# EAGLE design Particle2NodeMCU (EAGLE 7.3.0)
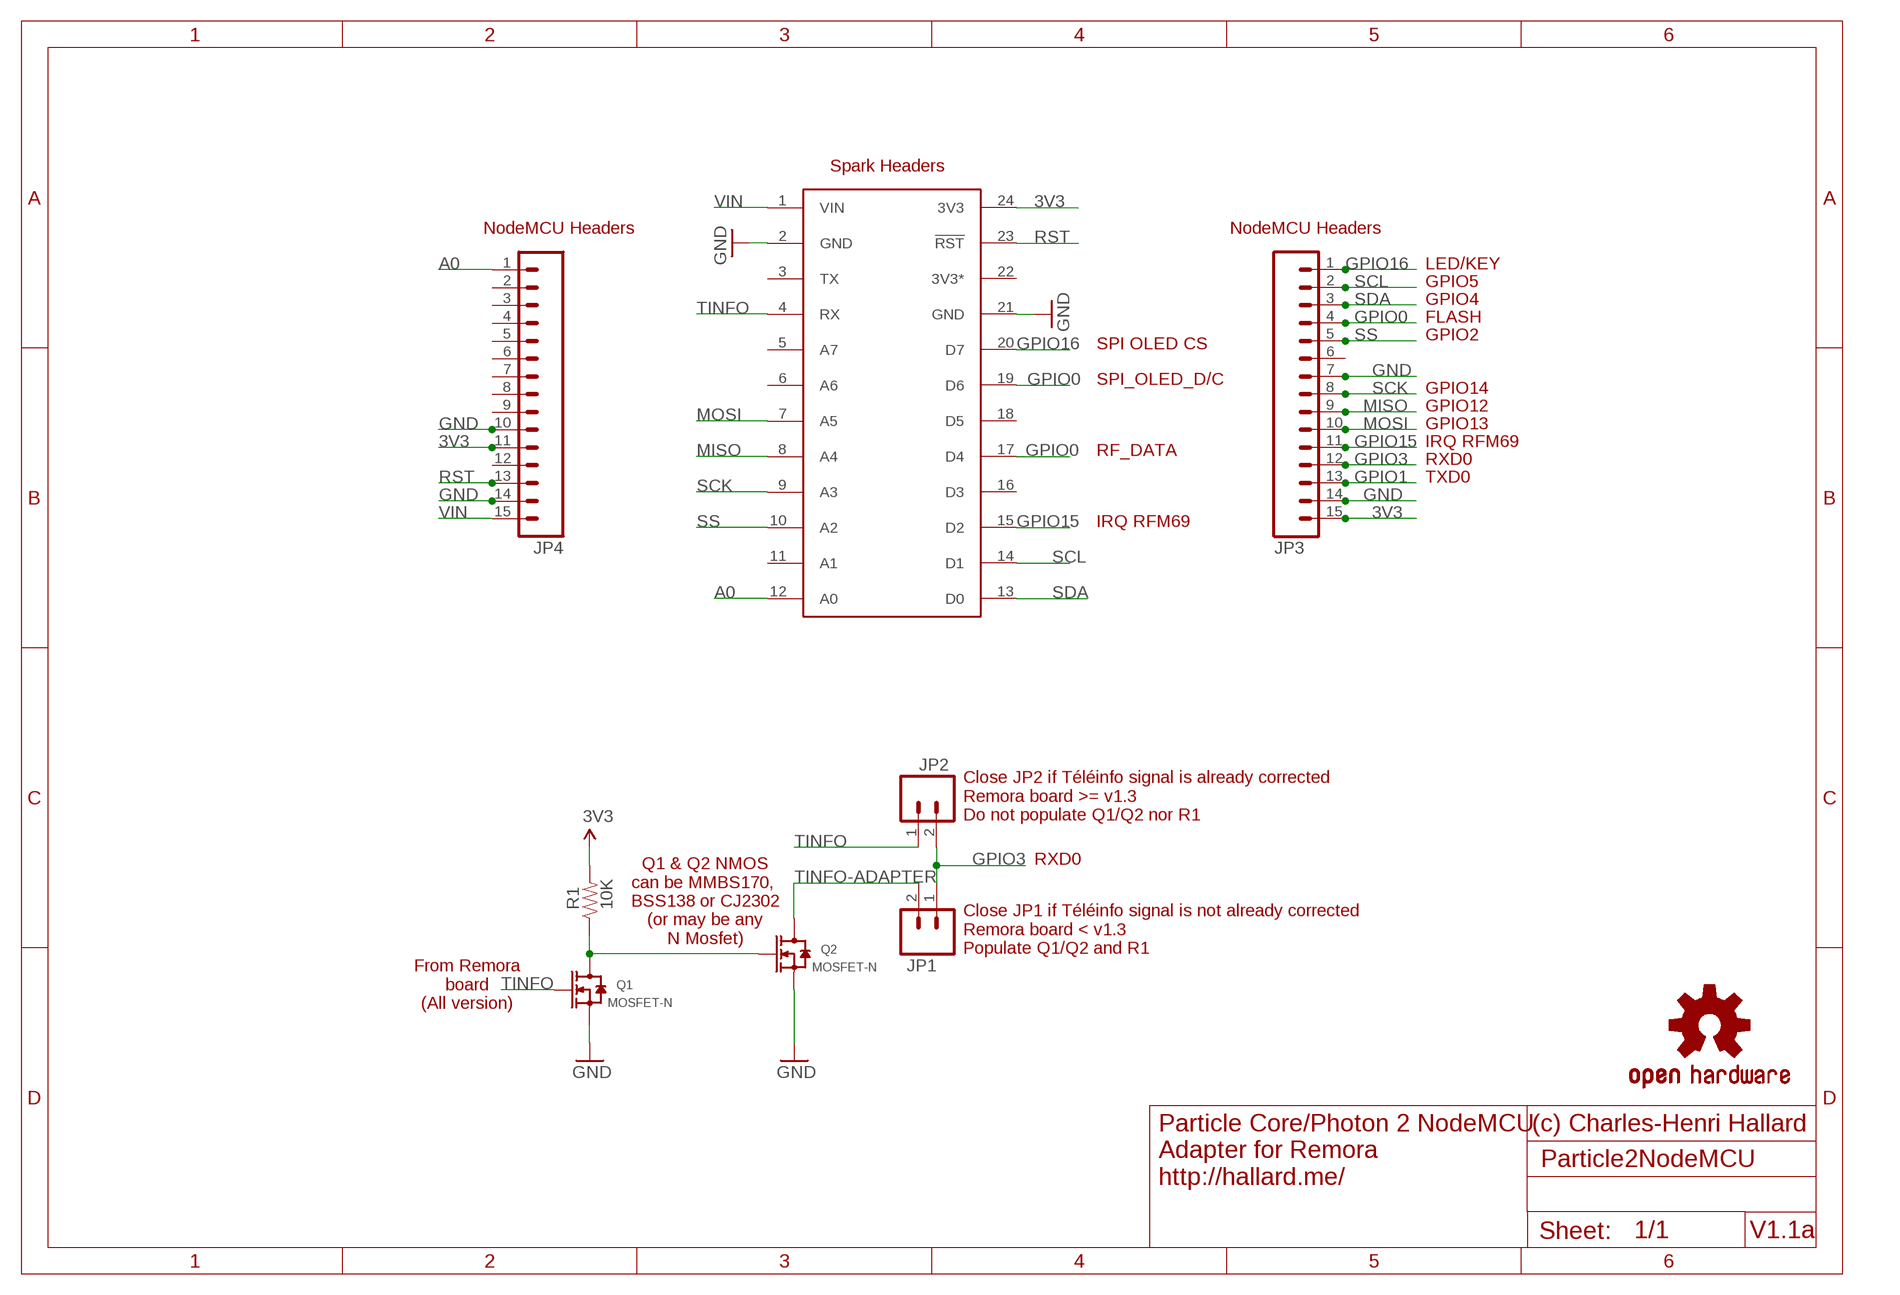
[diagram p0: schematic, sheet 1]

## Parts
JP1  M02LOCK  [1X02_LOCK]
JP2  M02LOCK  [1X02_LOCK]
JP3  M15  [1X15]
JP4  M15  [1X15]
LOGO1  OSHW-LOGOM  [OSHW-LOGO-M]
LOGO2  OSHW-LOGOM  [OSHW-LOGO-M]
Q1  MOSFET-N  MOSFET-N-''  [SOT23]
Q2  MOSFET-N  MOSFET-N-''  [SOT23]
R1  10K  RESISTOR0805-RES  [0805-RES]
U$2  SPARK_CORECORE  [SPARK_CORE]

## Nets
3V3: JP3.15 JP4.11 R1.2 U$2.24(3V3)
A0: JP4.1 U$2.12(A0)
GND: JP3.7 JP3.14 JP4.10 JP4.14 Q1.2(S) Q2.2(S) U$2.2(GND) U$2.21(GND)
GPIO0: JP3.4 U$2.17(D4) U$2.19(D6)
GPIO1: JP3.13
GPIO3: JP1.1 JP2.2 JP3.12
GPIO15: JP3.11 U$2.15(D2)
GPIO16: JP3.1 U$2.20(D7)
MISO: JP3.9 U$2.8(A4)
MOSI: JP3.10 U$2.7(A5)
N$3: Q1.3(D) Q2.1(G) R1.1
RST: JP4.13 U$2.23(!RST)
SCK: JP3.8 U$2.9(A3)
SCL: JP3.2 U$2.14(D1)
SDA: JP3.3 U$2.13(D0)
SS: JP3.5 U$2.10(A2)
TINFO: JP2.1 Q1.1(G) U$2.4(RX)
TINFO-ADAPTER: JP1.2 Q2.3(D)
VIN: JP4.15 U$2.1(VIN)
Unconnected: JP3.6 JP4.2 JP4.3 JP4.4 JP4.5 JP4.6 JP4.7 JP4.8 JP4.9 JP4.12 U$2.3(TX) U$2.5(A7) U$2.6(A6) U$2.11(A1) U$2.16(D3) U$2.18(D5)

## Notes on the sheet
- Spark Headers
- NodeMCU Headers | NodeMCU Headers
- LED/KEY
- GPIO5
- GPIO4
- FLASH
- GPIO2
- SPI OLED CS
- SPI_OLED_D/C
- GPIO14
- GPIO12
- GPIO13
- IRQ RFM69
- RF_DATA
- RXD0
- TXD0
- IRQ RFM69
- Close JP2 if Téléinfo signal is already corrected
  Remora board >= v1.3
  Do not populate Q1/Q2 nor R1
- RXD0
- Q1 & Q2 NMOS
  can be MMBS170, 
  BSS138 or CJ2302
  (or may be any
  N Mosfet)
- Close JP1 if Téléinfo signal is not already corrected
  Remora board < v1.3
  Populate Q1/Q2 and R1
- From Remora
  board
  (All version)
- (c) Charles-Henri Hallard
- Particle Core/Photon 2 NodeMCU
  Adapter for Remora
  http://hallard.me/
- V1.1a

## Power pins joined to a net without a drawn wire
3V3*: U$2.22(3V3*)

## Library data of the parts
JP1 JP2 = SparkFun-Connectors:M02: Standard 2-pin 0.1" header. Use with - straight break away headers ( PRT-00116) - right angle break away headers (PRT-00553) - swiss pins (PRT-00743) - machine pins (PRT-00117) - female headers (PRT-00115) Molex polarized connector foot print use with: PRT-08233 with associated crimp pins and housings. 2.54_SCREWTERM for use with PRT-10571. 3.5mm Screw Terminal footprints for PRT-08084 5mm Screw Terminal footprints for use with PRT-08432
JP3 JP4 = SparkFun-Connectors:M15: Header 15 Standard 15-pin 0.1" header. Use with straight break away headers (SKU : PRT-00116), right angle break away headers (PRT-00553), swiss pins (PRT-00743), machine pins (PRT-00117), and female headers (PRT-00115).
LOGO1 LOGO2 = SparkFun-Aesthetics:OSHW-LOGO: Open Source Hardware Logo This logo indicates the piece of hardware it is found on incorporates a OSHW license and/or adheres to the definition of open source hardware found here: http://freedomdefined.org/OSHW
Q1 Q2 = Seeed-Discrete:MOSFET-N: CJ2302：SMD MOSFET N-CH 20V-2.1A
R1 = _c2h:RESISTOR: Resistor Basic schematic elements and footprints for 0603, 1206, and PTH resistors.
U$2 = Spark:SPARK_CORE

## Board
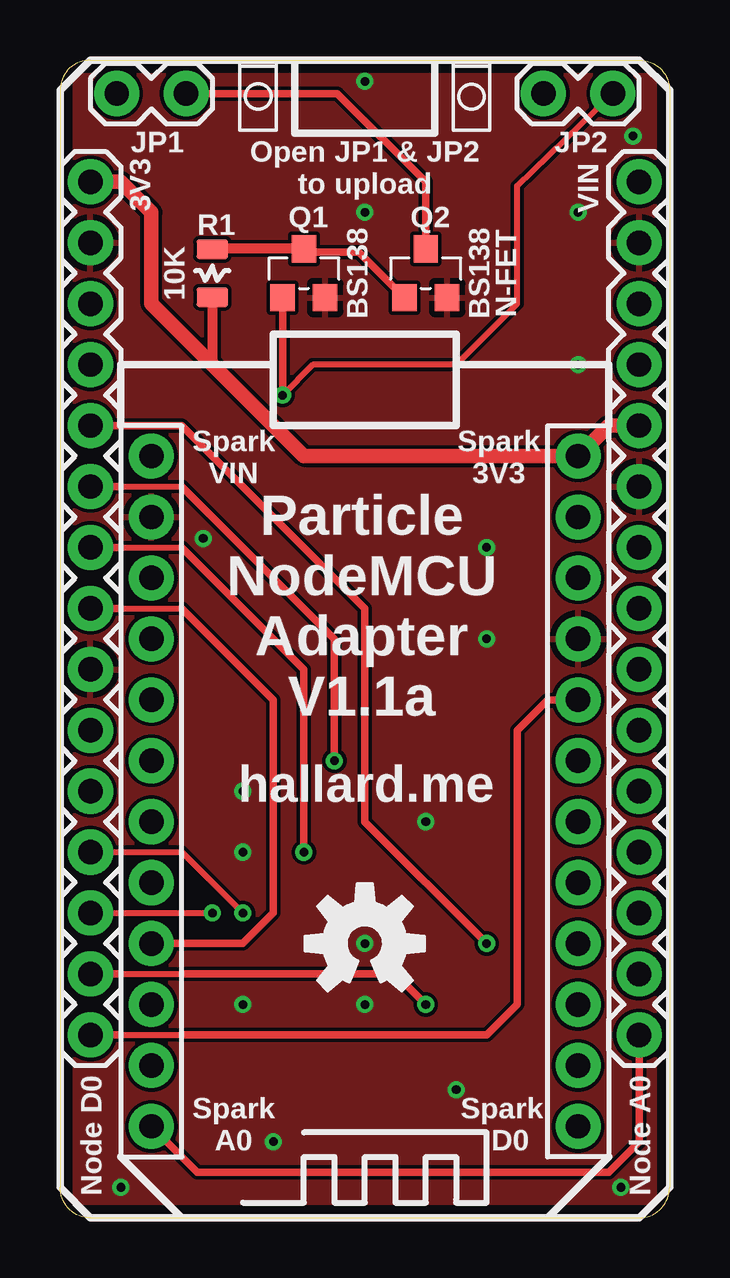
[diagram p1: board, top side]
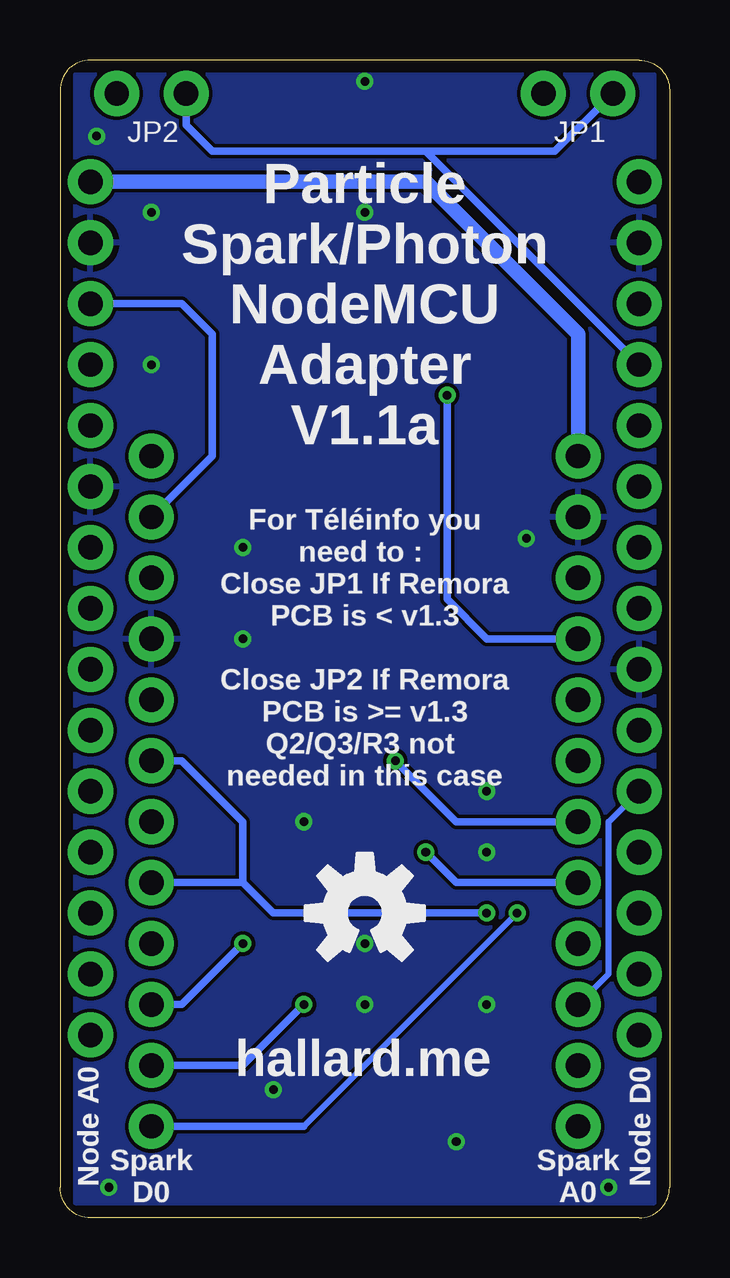
[diagram p2: board, bottom side, seen from below]

Size 25.4 x 48.26 mm. Coordinates in mm from the lower left corner, seen from the top.
Outline: 1.27,0 24.13,0 arc90 25.4,1.27 25.4,46.99 arc90 24.13,48.26 1.27,48.26 arc90 0,46.99 0,1.27 arc90 1.27,0
Copper layers (1*16): Top 0.035mm / dielectric 1.5mm / Bottom 0.035mm
Design rules "SeeedStudio_2layer_DRU_no_angle_20140221": minimum track width 6mil, minimum drill 12mil, track to track 6mil, track to pad 6mil, pad to pad 6mil, via to via 6mil, smd to smd 0mil, copper to edge 10mil, drill to drill 10mil, minimum pad ring 10mil, minimum via ring 6mil, stop-mask expansion 2mil, vias tented up to drill 100mil, thermal gap 10mil

### Footprints (pad centres in the part's own frame; a part is rotated, then mirrored left to right if it is on the bottom)
1X02_LOCK = drill 1.016 pad 1.88: 1 -0.178,0; 2 2.718,0
1X15 = drill 1.016 pad 1.88: 1 0,0; 2 2.54,0; 3 5.08,0; 4 7.62,0; 5 10.16,0; 6 12.7,0; 7 15.24,0; 8 17.78,0; 9 20.32,0; 10 22.86,0; 11 25.4,0; 12 27.94,0; 13 30.48,0; 14 33.02,0; 15 35.56,0
SOT23 = smd 1.016 x 1.143: 1 -0.889,-1.016; 2 0.889,-1.016; 3 0,1.016
0805-RES = smd 0.8 x 1.3: 1 -1,0; 2 1,0
SPARK_CORE = drill 1.016 pad 1.88: 1 -8.89,13.97; 2 -8.89,11.43; 3 -8.89,8.89; 4 -8.89,6.35; 5 -8.89,3.81; 6 -8.89,1.27; 7 -8.89,-1.27; 8 -8.89,-3.81; 9 -8.89,-6.35; 10 -8.89,-8.89; 11 -8.89,-11.43; 12 -8.89,-13.97; 13 8.89,-13.97; 14 8.89,-11.43; 15 8.89,-8.89; 16 8.89,-6.35; 17 8.89,-3.81; 18 8.89,-1.27; 19 8.89,1.27; 20 8.89,3.81; 21 8.89,6.35; 22 8.89,8.89; 23 8.89,11.43; 24 8.89,13.97

### Placement (x,y rotation side)
JP1  2.54,46.86 0 top
JP2  22.86,46.86 180 top
JP3  1.27,7.62 90 top
JP4  24.13,7.62 90 top
LOGO1  12.7,11.43 0 top
LOGO2  12.7,12.7 0 bottom
Q1  10.16,39.37 0 top
Q2  15.24,39.37 0 top
R1  6.35,39.37 270 top
U$2  12.7,17.78 0 top

### Tracks (layer width: path | path; a pad name or v marks a point on that pad's centre or on a via)
3V3
  Top 0.406: R1.2 6.35,35.56
  Top 0.61: JP3.15 2.54,43.18 3.81,41.91 3.81,38.1 6.35,35.56 10.16,31.75 U$2.24 22.86,33.02 JP4.11
A0
  Top 0.305: JP4.1 24.13,3.17 22.86,1.91 5.71,1.91 U$2.12
GND  (via drill 0.36 pad 0.71)
  other vias: 12.7,41.91 21.59,41.91 17.78,27.94 5.97,28.32 8.89,3.17 2.54,1.27 23.37,1.27 23.88,45.09 7.62,8.89 12.7,11.43 12.7,8.89 16.51,5.33 7.62,15.24 7.62,17.78 21.59,35.56 15.24,16.51 17.78,24.13 12.7,47.37
  pour Top: 0.64,47.62 24.77,47.62 24.77,0.64 0.64,0.64
  pour Bottom: 0.64,47.62 24.77,47.62 24.77,0.64 0.64,0.64
GPIO0  (via drill 0.36 pad 0.71)
  Top 0.254: JP3.4 5.08,15.24 v7.62,12.7
  Bottom 0.305: v7.62,12.7 16.51,12.7 17.78,13.97 | U$2.19 20.32,19.05 17.78,16.51 17.78,13.97 | U$2.17 17.78,13.97
GPIO3
  Bottom 0.305: JP1.1 4.78,44.45 10.16,44.45 | JP2.2 20.14,45.54 19.05,44.45 10.16,44.45 | JP3.12 10.16,44.45
GPIO15  (via drill 0.36 pad 0.71)
  Top 0.305: JP3.11 5.08,33.02 12.7,25.4 12.7,16.51 v17.78,11.43
  Bottom 0.305: v17.78,11.43 20.32,8.89 U$2.15
GPIO16
  Top 0.254: 2.54,7.62 5.08,7.62
  Top 0.305: U$2.20 20.32,21.59 19.05,20.32 19.05,8.89 17.78,7.62 5.08,7.62 | JP3.1 2.54,7.62
MISO  (via drill 0.36 pad 0.71)
  Top 0.254: 2.54,27.94 5.08,27.94
  Top 0.305: v10.16,15.24 10.16,22.86 5.08,27.94 | JP3.9 2.54,27.94
  Bottom 0.305: U$2.8 8.89,13.97 v10.16,15.24
MOSI  (via drill 0.36 pad 0.71)
  Top 0.254: 2.54,30.48 5.08,30.48
  Top 0.305: v11.43,19.05 11.43,24.13 5.08,30.48 | JP3.10 2.54,30.48
  Bottom 0.305: v11.43,19.05 8.89,16.51 U$2.7
N$3
  Top 0.305: Q1.3 10.29,40.26 12.45,40.26 Q2.1
  Top 0.406: Q1.3 6.37,40.39 R1.1
RST
  Bottom 0.305: U$2.23 19.05,31.75 19.05,36.83 20.32,38.1 JP4.13
SCK
  Top 0.254: 2.54,25.4 5.08,25.4
  Top 0.305: U$2.9 7.62,11.43 8.89,12.7 8.89,21.59 5.08,25.4 | JP3.8 2.54,25.4
SCL  (via drill 0.36 pad 0.71)
  Top 0.254: 2.54,10.16 5.08,10.16
  Top 0.305: JP3.2 2.54,10.16 | 5.08,10.16 13.97,10.16 v15.24,8.89
  Bottom 0.305: v15.24,8.89 17.78,6.35 U$2.14
SDA  (via drill 0.36 pad 0.71)
  Top 0.254: JP3.3 v6.35,12.7
  Bottom 0.254: v6.35,12.7 15.24,3.81
  Bottom 0.305: U$2.13 15.24,3.81
SS
  Bottom 0.254: JP3.5 2.54,16.51 2.54,10.16 U$2.10
TINFO  (via drill 0.36 pad 0.71)
  Top 0.254: v9.27,34.29 10.54,35.56 16.51,35.56 19.05,38.1 19.05,43 JP2.1
  Top 0.305: v9.27,34.29 Q1.1
  Bottom 0.305: U$2.4 7.62,24.13 9.27,25.78 v9.27,34.29
TINFO-ADAPTER
  Top 0.305: JP1.2 11.56,46.86 15.24,43.18 Q2.3
VIN
  Bottom 0.61: U$2.1 3.81,36.83 10.16,43.18 JP4.15

### Text on the board
tPlace: 3V3 | Open JP1 & JP2 / to upload | VIN | BS138 | BS138 | N-FET | Spark / VIN | Spark / 3V3 | Particle / NodeMCU / Adapter / V1.1a | hallard.me | Node D0 | Spark / A0 | Spark / D0 | Node A0
bPlace: JP1 | JP2 | Particle / Spark/Photon / NodeMCU / Adapter / V1.1a | For Téléinfo you / need to : / Close JP1 If Remora / PCB is < v1.3 / / Close JP2 If Remora / PCB is >= v1.3 / Q2/Q3/R3 not / needed in this case | hallard.me | Node D0 | Node A0 | Spark / A0 | Spark / D0
_tNames: JP1 | JP2 | R1 | Q1 | Q2